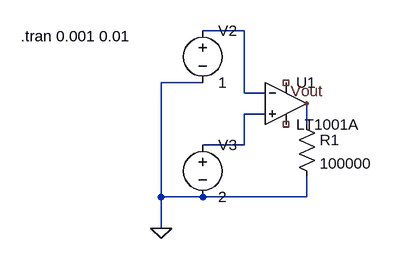
[diagram p0: schematic OpAmpOpenLoop.asc]
OpAmpOpenLoop.asc, the LTspice schematic file:
Version 4
SHEET 1 880 680
WIRE 208 192 144 192
WIRE 144 272 80 272
WIRE 208 288 208 192
WIRE 240 288 208 288
WIRE 240 320 208 320
WIRE 304 336 304 304
WIRE 208 368 208 320
WIRE 208 368 144 368
WIRE 80 448 80 272
WIRE 144 448 80 448
WIRE 304 448 304 416
WIRE 304 448 144 448
WIRE 80 496 80 448
FLAG 80 496 0
FLAG 304 304 Vout
SYMBOL Opamps/LT1001A 272 240 R0
SYMATTR InstName U1
SYMBOL voltage 144 176 R0
SYMATTR InstName V2
SYMATTR Value 1
SYMBOL voltage 144 352 R0
SYMATTR InstName V3
SYMATTR Value 2
SYMBOL res 288 320 R0
SYMATTR InstName R1
SYMATTR Value 100000
TEXT -136 200 Left 2 !.tran 0.001 0.01

The netlist it stands for:
* OpAmpOpenLoop.asc
XU1 N002 N001 NC_01 NC_02 Vout LT1001  ; LT1001A, pins In+ In- V+ V- OUT
V2 N001 0 1
V3 N002 0 2
R1 Vout 0 100000
.tran 0.001 0.01
.lib LTC.lib
.backanno
.end